# EAGLE board candle (EAGLE 8.5.0)
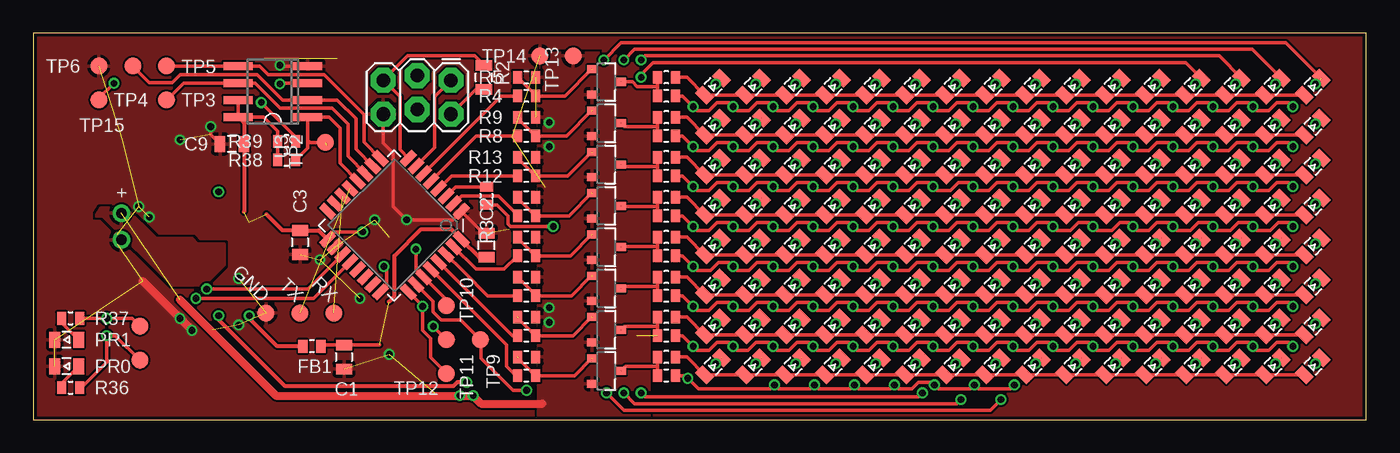
[diagram p1: board, top side]
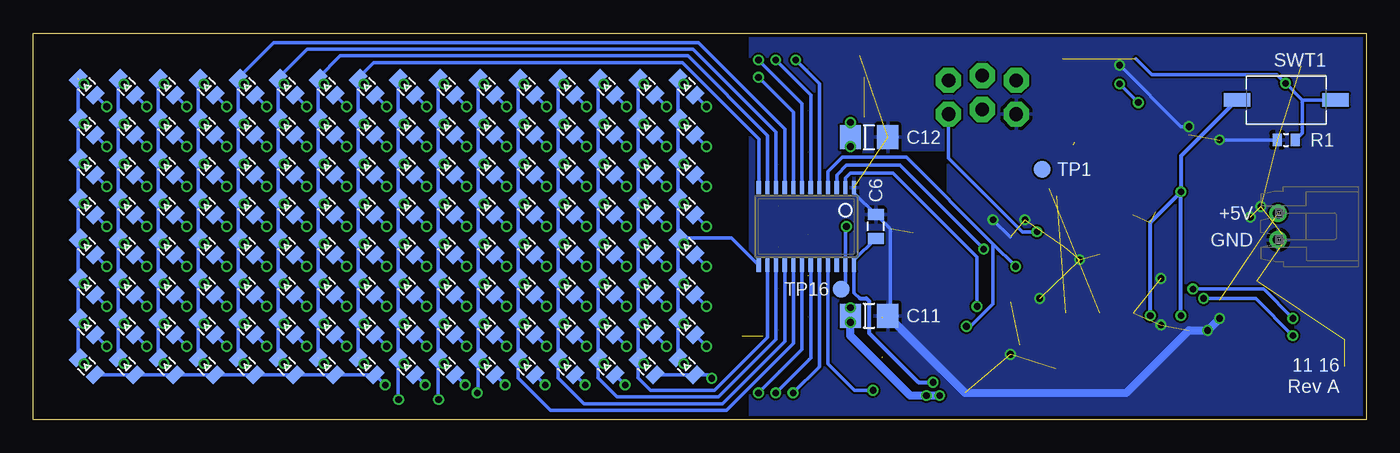
[diagram p2: board, bottom side, seen from below]

Size 100 x 29 mm. Coordinates in mm from the lower left corner, seen from the top.
Outline: 0,0 100,0 100,29 0,29 0,0
Copper layers (1*16): Top 0.035mm / dielectric 1.5mm / Bottom 0.035mm
Design rules "SeeedStudio_2layer_DRU_no_angle_20140221 *": minimum track width 6mil, minimum drill 12mil, track to track 6mil, track to pad 6mil, pad to pad 6mil, via to via 6mil, smd to smd 0mil, copper to edge 10mil, drill to drill 10mil, minimum pad ring 10mil, minimum via ring 6mil, stop-mask expansion 2mil, vias tented up to drill 100mil, thermal gap 10mil

## Footprints (pad centres in the part's own frame; a part is rotated, then mirrored left to right if it is on the bottom)
0805 = smd 0.8 x 1.2: 1 -0.9,0; 2 0.9,0
1206_POL = smd 1.6 x 1.8: 1 -1.4,0; 2 1.4,0
0805_LED = smd 0.8 x 1.2: A -0.9,0; C 0.9,0
0603 = smd 0.7 x 0.95: 1 -0.675,0; 2 0.675,0
B1,27 = smd 1.27 x 1.27: TP 0,0
2X3_LOCK = drill 1.016 pad 1.88 octagon: 1 -2.54,-1.27; 2 -2.54,1.27; 3 0,-1.626; 4 0,0.914; 5 2.54,-1.27; 6 2.54,1.27
1X2_MOLEX_53254 = drill 0.8: 1 -1,0; 2 1,0
SOT23 = smd 0.6 x 0.7: 1 -0.95,-1.1; 2 0.95,-1.1; 3 0,1.1
BTN_SMD_2PIN = smd 2 x 1: 1 -3.7,0; 2 3.7,0
TQFP32 = smd 1.27 x 0.559: 1 -4.42,2.8; 2 -4.42,2; 3 -4.42,1.2; 4 -4.42,0.4; 5 -4.42,-0.4; 6 -4.42,-1.2; 7 -4.42,-2; 8 -4.42,-2.8; 17 4.166,-2.8; 18 4.166,-2; 19 4.166,-1.2; 20 4.166,-0.4; 21 4.166,0.4; 22 4.166,1.2; 23 4.166,2; 24 4.166,2.8 | smd 0.559 x 1.27: 9 -2.927,-4.293; 10 -2.127,-4.293; 11 -1.327,-4.293; 12 -0.527,-4.293; 13 0.273,-4.293; 14 1.073,-4.293; 15 1.873,-4.293; 16 2.673,-4.293; 25 2.673,4.293; 26 1.873,4.293; 27 1.073,4.293; 28 0.273,4.293; 29 -0.527,4.293; 30 -1.327,4.293; 31 -2.127,4.293; 32 -2.927,4.293
SO8 = smd 0.6 x 2.2: 1 -1.905,-2.6; 2 -0.635,-2.6; 3 0.635,-2.6; 4 1.905,-2.6; 5 1.905,2.6; 6 0.635,2.6; 7 -0.635,2.6; 8 -1.905,2.6
TSSOP24 = smd 0.305 x 0.991: 1 -3.575,-2.918; 2 -2.925,-2.918; 3 -2.275,-2.918; 4 -1.625,-2.918; 5 -0.975,-2.918; 6 -0.325,-2.918; 7 0.325,-2.918; 8 0.975,-2.918; 9 1.625,-2.918; 10 2.275,-2.918; 11 2.925,-2.918; 12 3.575,-2.918; 13 3.575,2.918; 14 2.925,2.918; 15 2.275,2.918; 16 1.625,2.918; 17 0.975,2.918; 18 0.325,2.918; 19 -0.325,2.918; 20 -0.975,2.918; 21 -1.625,2.918; 22 -2.275,2.918; 23 -2.925,2.918; 24 -3.575,2.918

## Placement (x,y rotation side)
C1  10u  [0805]  23.3,4.7 270 top
C2  .1u  [0805]  34,13.1 90 top
C3  .1u  [0805]  20,13.3 270 top
C6  .1u  [0805]  36.8,14.5 90 bottom
C9  .1u  [0805]  14.9,20.7 180 top
C11  [1206_POL]  37.3,7.8 0 bottom
C12  [1206_POL]  37.3,21.2 0 bottom
D1  [0805_LED]  96,25 45 top
D2  [0805_LED]  93,25 45 top
D3  [0805_LED]  90,25 45 top
D4  [0805_LED]  87,25 45 top
D5  [0805_LED]  84,25 45 top
D6  [0805_LED]  81,25 45 top
D7  [0805_LED]  78,25 45 top
D8  [0805_LED]  75,25 45 top
D9  [0805_LED]  72,25 45 top
D10  [0805_LED]  69,25 45 top
D11  [0805_LED]  66,25 45 top
D12  [0805_LED]  63,25 45 top
D13  [0805_LED]  60,25 45 top
D14  [0805_LED]  57,25 45 top
D15  [0805_LED]  54,25 45 top
D16  [0805_LED]  51,25 45 top
D17  [0805_LED]  96,25 135 bottom
D18  [0805_LED]  93,25 135 bottom
D19  [0805_LED]  90,25 135 bottom
D20  [0805_LED]  87,25 135 bottom
D21  [0805_LED]  84,25 135 bottom
D22  [0805_LED]  81,25 135 bottom
D23  [0805_LED]  78,25 135 bottom
D24  [0805_LED]  75,25 135 bottom
D25  [0805_LED]  72,25 135 bottom
D26  [0805_LED]  69,25 135 bottom
D27  [0805_LED]  66,25 135 bottom
D28  [0805_LED]  63,25 135 bottom
D29  [0805_LED]  60,25 135 bottom
D30  [0805_LED]  57,25 135 bottom
D31  [0805_LED]  54,25 135 bottom
D32  [0805_LED]  51,25 135 bottom
D33  [0805_LED]  96,22 45 top
D34  [0805_LED]  93,22 45 top
D35  [0805_LED]  90,22 45 top
D36  [0805_LED]  87,22 45 top
D37  [0805_LED]  84,22 45 top
D38  [0805_LED]  81,22 45 top
D39  [0805_LED]  78,22 45 top
D40  [0805_LED]  75,22 45 top
D41  [0805_LED]  72,22 45 top
D42  [0805_LED]  69,22 45 top
D43  [0805_LED]  66,22 45 top
D44  [0805_LED]  63,22 45 top
D45  [0805_LED]  60,22 45 top
D46  [0805_LED]  57,22 45 top
D47  [0805_LED]  54,22 45 top
D48  [0805_LED]  51,22 45 top
D49  [0805_LED]  96,22 135 bottom
D50  [0805_LED]  93,22 135 bottom
D51  [0805_LED]  90,22 135 bottom
D52  [0805_LED]  87,22 135 bottom
D53  [0805_LED]  84,22 135 bottom
D54  [0805_LED]  81,22 135 bottom
D55  [0805_LED]  78,22 135 bottom
D56  [0805_LED]  75,22 135 bottom
D57  [0805_LED]  72,22 135 bottom
D58  [0805_LED]  69,22 135 bottom
D59  [0805_LED]  66,22 135 bottom
D60  [0805_LED]  63,22 135 bottom
D61  [0805_LED]  60,22 135 bottom
D62  [0805_LED]  57,22 135 bottom
D63  [0805_LED]  54,22 135 bottom
D64  [0805_LED]  51,22 135 bottom
D65  [0805_LED]  96,19 45 top
D66  [0805_LED]  93,19 45 top
D67  [0805_LED]  90,19 45 top
D68  [0805_LED]  87,19 45 top
D69  [0805_LED]  84,19 45 top
D70  [0805_LED]  81,19 45 top
D71  [0805_LED]  78,19 45 top
D72  [0805_LED]  75,19 45 top
D73  [0805_LED]  72,19 45 top
D74  [0805_LED]  69,19 45 top
D75  [0805_LED]  66,19 45 top
D76  [0805_LED]  63,19 45 top
D77  [0805_LED]  60,19 45 top
D78  [0805_LED]  57,19 45 top
D79  [0805_LED]  54,19 45 top
D80  [0805_LED]  51,19 45 top
D81  [0805_LED]  96,19 135 bottom
D82  [0805_LED]  93,19 135 bottom
D83  [0805_LED]  90,19 135 bottom
D84  [0805_LED]  87,19 135 bottom
D85  [0805_LED]  84,19 135 bottom
D86  [0805_LED]  81,19 135 bottom
D87  [0805_LED]  78,19 135 bottom
D88  [0805_LED]  75,19 135 bottom
D89  [0805_LED]  72,19 135 bottom
D90  [0805_LED]  69,19 135 bottom
D91  [0805_LED]  66,19 135 bottom
D92  [0805_LED]  63,19 135 bottom
D93  [0805_LED]  60,19 135 bottom
D94  [0805_LED]  57,19 135 bottom
D95  [0805_LED]  54,19 135 bottom
D96  [0805_LED]  51,19 135 bottom
D97  [0805_LED]  96,16 45 top
D98  [0805_LED]  93,16 45 top
D99  [0805_LED]  90,16 45 top
D100  [0805_LED]  87,16 45 top
D101  [0805_LED]  84,16 45 top
D102  [0805_LED]  81,16 45 top
D103  [0805_LED]  78,16 45 top
D104  [0805_LED]  75,16 45 top
D105  [0805_LED]  72,16 45 top
D106  [0805_LED]  69,16 45 top
D107  [0805_LED]  66,16 45 top
D108  [0805_LED]  63,16 45 top
D109  [0805_LED]  60,16 45 top
D110  [0805_LED]  57,16 45 top
D111  [0805_LED]  54,16 45 top
D112  [0805_LED]  51,16 45 top
D113  [0805_LED]  96,16 135 bottom
D114  [0805_LED]  93,16 135 bottom
D115  [0805_LED]  90,16 135 bottom
D116  [0805_LED]  87,16 135 bottom
D117  [0805_LED]  84,16 135 bottom
D118  [0805_LED]  81,16 135 bottom
D119  [0805_LED]  78,16 135 bottom
D120  [0805_LED]  75,16 135 bottom
D121  [0805_LED]  72,16 135 bottom
D122  [0805_LED]  69,16 135 bottom
D123  [0805_LED]  66,16 135 bottom
D124  [0805_LED]  63,16 135 bottom
D125  [0805_LED]  60,16 135 bottom
D126  [0805_LED]  57,16 135 bottom
D127  [0805_LED]  54,16 135 bottom
D128  [0805_LED]  51,16 135 bottom
D129  [0805_LED]  96,13 45 top
D130  [0805_LED]  93,13 45 top
D131  [0805_LED]  90,13 45 top
D132  [0805_LED]  87,13 45 top
D133  [0805_LED]  84,13 45 top
D134  [0805_LED]  81,13 45 top
D135  [0805_LED]  78,13 45 top
D136  [0805_LED]  75,13 45 top
D137  [0805_LED]  72,13 45 top
D138  [0805_LED]  69,13 45 top
D139  [0805_LED]  66,13 45 top
D140  [0805_LED]  63,13 45 top
D141  [0805_LED]  60,13 45 top
D142  [0805_LED]  57,13 45 top
D143  [0805_LED]  54,13 45 top
D144  [0805_LED]  51,13 45 top
D145  [0805_LED]  96,13 135 bottom
D146  [0805_LED]  93,13 135 bottom
D147  [0805_LED]  90,13 135 bottom
D148  [0805_LED]  87,13 135 bottom
D149  [0805_LED]  84,13 135 bottom
D150  [0805_LED]  81,13 135 bottom
D151  [0805_LED]  78,13 135 bottom
D152  [0805_LED]  75,13 135 bottom
D153  [0805_LED]  72,13 135 bottom
D154  [0805_LED]  69,13 135 bottom
D155  [0805_LED]  66,13 135 bottom
D156  [0805_LED]  63,13 135 bottom
D157  [0805_LED]  60,13 135 bottom
D158  [0805_LED]  57,13 135 bottom
D159  [0805_LED]  54,13 135 bottom
D160  [0805_LED]  51,13 135 bottom
D161  [0805_LED]  96,10 45 top
D162  [0805_LED]  93,10 45 top
D163  [0805_LED]  90,10 45 top
D164  [0805_LED]  87,10 45 top
D165  [0805_LED]  84,10 45 top
D166  [0805_LED]  81,10 45 top
D167  [0805_LED]  78,10 45 top
D168  [0805_LED]  75,10 45 top
D169  [0805_LED]  72,10 45 top
D170  [0805_LED]  69,10 45 top
D171  [0805_LED]  66,10 45 top
D172  [0805_LED]  63,10 45 top
D173  [0805_LED]  60,10 45 top
D174  [0805_LED]  57,10 45 top
D175  [0805_LED]  54,10 45 top
D176  [0805_LED]  51,10 45 top
D177  [0805_LED]  96,10 135 bottom
D178  [0805_LED]  93,10 135 bottom
D179  [0805_LED]  90,10 135 bottom
D180  [0805_LED]  87,10 135 bottom
D181  [0805_LED]  84,10 135 bottom
D182  [0805_LED]  81,10 135 bottom
D183  [0805_LED]  78,10 135 bottom
D184  [0805_LED]  75,10 135 bottom
D185  [0805_LED]  72,10 135 bottom
D186  [0805_LED]  69,10 135 bottom
D187  [0805_LED]  66,10 135 bottom
D188  [0805_LED]  63,10 135 bottom
D189  [0805_LED]  60,10 135 bottom
D190  [0805_LED]  57,10 135 bottom
D191  [0805_LED]  54,10 135 bottom
D192  [0805_LED]  51,10 135 bottom
D193  [0805_LED]  96,7 45 top
D194  [0805_LED]  93,7 45 top
D195  [0805_LED]  90,7 45 top
D196  [0805_LED]  87,7 45 top
D197  [0805_LED]  84,7 45 top
D198  [0805_LED]  81,7 45 top
D199  [0805_LED]  78,7 45 top
D200  [0805_LED]  75,7 45 top
D201  [0805_LED]  72,7 45 top
D202  [0805_LED]  69,7 45 top
D203  [0805_LED]  66,7 45 top
D204  [0805_LED]  63,7 45 top
D205  [0805_LED]  60,7 45 top
D206  [0805_LED]  57,7 45 top
D207  [0805_LED]  54,7 45 top
D208  [0805_LED]  51,7 45 top
D209  [0805_LED]  96,7 135 bottom
D210  [0805_LED]  93,7 135 bottom
D211  [0805_LED]  90,7 135 bottom
D212  [0805_LED]  87,7 135 bottom
D213  [0805_LED]  84,7 135 bottom
D214  [0805_LED]  81,7 135 bottom
D215  [0805_LED]  78,7 135 bottom
D216  [0805_LED]  75,7 135 bottom
D217  [0805_LED]  72,7 135 bottom
D218  [0805_LED]  69,7 135 bottom
D219  [0805_LED]  66,7 135 bottom
D220  [0805_LED]  63,7 135 bottom
D221  [0805_LED]  60,7 135 bottom
D222  [0805_LED]  57,7 135 bottom
D223  [0805_LED]  54,7 135 bottom
D224  [0805_LED]  51,7 135 bottom
D225  [0805_LED]  96,4 45 top
D226  [0805_LED]  93,4 45 top
D227  [0805_LED]  90,4 45 top
D228  [0805_LED]  87,4 45 top
D229  [0805_LED]  84,4 45 top
D230  [0805_LED]  81,4 45 top
D231  [0805_LED]  78,4 45 top
D232  [0805_LED]  75,4 45 top
D233  [0805_LED]  72,4 45 top
D234  [0805_LED]  69,4 45 top
D235  [0805_LED]  66,4 45 top
D236  [0805_LED]  63,4 45 top
D237  [0805_LED]  60,4 45 top
D238  [0805_LED]  57,4 45 top
D239  [0805_LED]  54,4 45 top
D240  [0805_LED]  51,4 45 top
D241  [0805_LED]  96,4 135 bottom
D242  [0805_LED]  93,4 135 bottom
D243  [0805_LED]  90,4 135 bottom
D244  [0805_LED]  87,4 135 bottom
D245  [0805_LED]  84,4 135 bottom
D246  [0805_LED]  81,4 135 bottom
D247  [0805_LED]  78,4 135 bottom
D248  [0805_LED]  75,4 135 bottom
D249  [0805_LED]  72,4 135 bottom
D250  [0805_LED]  69,4 135 bottom
D251  [0805_LED]  66,4 135 bottom
D252  [0805_LED]  63,4 135 bottom
D253  [0805_LED]  60,4 135 bottom
D254  [0805_LED]  57,4 135 bottom
D255  [0805_LED]  54,4 135 bottom
D256  [0805_LED]  51,4 135 bottom
D257  [0805_LED]  2.5,4 180 top
D258  [0805_LED]  2.5,6 180 top
FB1  FB_0603  [0603]  20.9,5.5 180 top
GND  TPB1,27  [B1,27]  17.46,8 0 top
J1  [2X3_LOCK]  28.8,24.2 180 top
J2  [1X2_MOLEX_53254]  6.6,14.5 270 bottom
Q1  [SOT23]  43,25.35 270 top
Q2  [SOT23]  43,22.25 270 top
Q3  [SOT23]  43,19.15 270 top
Q4  [SOT23]  43,16.05 270 top
Q5  [SOT23]  43,12.95 270 top
Q6  [SOT23]  43,9.85 270 top
Q7  [SOT23]  43,6.75 270 top
Q8  [SOT23]  43,3.65 270 top
R1  [0603]  6,21 0 bottom
R2  10k  [0805]  33.8,25.7 90 top
R3  [0603]  34,16.8 270 top
R4  [0603]  37,24.3 180 top
R5  [0603]  37,25.7 0 top
R6  [0603]  47.5,25.7 180 top
R7  [0603]  47.5,24.3 180 top
R8  [0603]  37,21.3 180 top
R9  [0603]  37,22.7 0 top
R10  [0603]  47.5,22.7 180 top
R11  [0603]  47.5,21.3 180 top
R12  [0603]  37,18.3 180 top
R13  [0603]  37,19.7 0 top
R14  [0603]  47.5,19.7 180 top
R15  [0603]  47.5,18.3 180 top
R16  [0603]  37,15.3 180 top
R17  [0603]  37,16.7 0 top
R18  [0603]  47.5,16.7 180 top
R19  [0603]  47.5,15.3 180 top
R20  [0603]  37,12.3 180 top
R21  [0603]  37,13.7 0 top
R22  [0603]  47.5,13.7 180 top
R23  [0603]  47.5,12.3 180 top
R24  [0603]  37,9.3 180 top
R25  [0603]  37,10.7 0 top
R26  [0603]  47.5,10.7 180 top
R27  [0603]  47.5,9.3 180 top
R28  [0603]  37,6.3 180 top
R29  [0603]  37,7.7 0 top
R30  [0603]  47.5,7.7 180 top
R31  [0603]  47.5,6.3 180 top
R32  [0603]  37,3.3 180 top
R33  [0603]  37,4.7 0 top
R34  [0603]  47.5,4.7 180 top
R35  [0603]  47.5,3.3 180 top
R36  [0603]  2.8,2.4 0 top
R37  [0603]  2.8,7.6 0 top
R38  10k  [0603]  19,19.5 180 top
R39  10k  [0603]  19,20.9 180 top
RX  TPB1,27  [B1,27]  22.54,8 0 top
SWT1  BUTTON_SMD_2P  [BTN_SMD_2PIN]  6,24 180 bottom
TP1  TPB1,27  [B1,27]  24.3,18.8 0 bottom
TP2  TPB1,27  [B1,27]  21.9,20.8 0 top
TP3  TPB1,27  [B1,27]  10,24 0 top
TP4  TPB1,27  [B1,27]  7.46,26.54 0 top
TP5  TPB1,27  [B1,27]  10,26.54 0 top
TP6  TPB1,27  [B1,27]  4.92,26.54 0 top
TP7  TPB1,27  [B1,27]  8,4.46 0 top
TP8  TPB1,27  [B1,27]  8,7 0 top
TP9  TPB1,27  [B1,27]  33.54,6 0 top
TP10  TPB1,27  [B1,27]  31,8.54 0 top
TP11  TPB1,27  [B1,27]  31,6 0 top
TP12  TPB1,27  [B1,27]  31,3.46 0 top
TP13  TPB1,27  [B1,27]  40.5,27.3 0 top
TP14  TPB1,27  [B1,27]  38,27.3 0 top
TP15  TPB1,27  [B1,27]  4.92,24 0 top
TP16  TPB1,27  [B1,27]  39.4,9.8 0 bottom
TX  TPB1,27  [B1,27]  20,8 0 top
U1  ATXMEGA_E5_TQFP  [TQFP32]  27,14.5 225 top
U3  S25FL  [SO8]  17.96,24.63 90 top
U4  STP16CPC26TSSOP24  [TSSOP24]  42,14.5 180 bottom

## Tracks (layer width: path | path; a pad name or v marks a point on that pad's centre or on a via)
!C0
  Top 0.254: U1.6 35.1,24.3 R4.2
!C0_  (1 unrouted)
  Top 0.254: R5.1 37.67,24.35 R4.1 39.9,24.3 Q1.1
!C1
  Top 0.254: U1.5 33.23,21.3 R8.2
!C2
  Top 0.254: U1.4 31.37,18.3 R12.2
!C3
  Top 0.254: U1.2 32.13,16.8 34.9,16.8 36.33,15.38 R16.2
!C3_  (1 unrouted)
  Top 0.254: 37.67,15.35 R16.1 | R16.1 36.33,16.65 R17.1 | Q4.1 40.2,15.3 R16.1
!C4
  Top 0.254: U1.31 33.21,11.3 35.33,11.3 R20.2
!C5
  Top 0.254: U1.30 32.19,11.19 32.3,11.08 34.08,9.3 R24.2
!C5_  (1 unrouted)
  Top 0.254: R25.1 37.67,9.35 R24.1 40.4,9.3 Q6.1
!C6
  Top 0.254: R28.2 35.95,6.3 U1.29
!C6_  (2 unrouted)
  Top 0.254: 36.33,7.65 R28.1 40.5,6.3 Q7.1
!C7
  Top 0.254: U1.28 35.5,5.61 35.5,4 36.2,3.3 R32.2
!C7_  (2 unrouted)
  Top 0.254: 36.33,4.65 R32.1 40.6,3.3 Q8.1
!DISP_OE  (via drill 0.5)
  Top 0.254: v37,2.2 36,2.2 33.6,4.6 33.6,6 TP9.TP 32.04,7.5 30.6,7.5 30,8.1 30,8.85 U1.26
  Bottom 0.254: U4.21 40.38,4.17 38.4,2.2 v37,2.2
!FLASH_CS  (1 unrouted)
  Top 0.254: 20.56,21 U3.1 22.18,22.72 23,21.9 23,19.25 U1.12 | 20.56,21 20.56,20.39 R38.1 | TP2.TP 20.76,20.8 20.56,21
!RESET
  Top 0.254: U1.8 27.5,20.25 27.5,24.23 J1.5 28.09,27.3 33.1,27.3 R2.2
BTN  (via drill 0.5)  (1 unrouted)
  Top 0.254: 4.92,24.12 v6.05,25.25
  Bottom 0.254: 17.3,27.1 16.1,25.9 6.7,25.9 v6.05,25.25 4.8,24 | 4.8,24 SWT1.1 | R1.2 4.8,21.52 4.8,24
COL0  (1 unrouted)
  Top 0.254: R7.2 46.83,25 | 46.83,25 R6.2 | Q1.3 44.95,25.35 45.3,25 46.83,25
COL1  (1 unrouted)
  Top 0.254: R11.2 46.83,22 | 46.83,22 R10.2 | Q2.3 44.35,22 46.83,22
COL2  (1 unrouted)
  Top 0.254: R15.2 46.83,19 | 46.83,19 R14.2 | Q3.3 44.25,19 46.83,19
COL3  (1 unrouted)
  Top 0.254: R19.2 46.83,16 | 46.83,16 R18.2 | Q4.3 44.15,16 46.83,16
COL4  (1 unrouted)
  Top 0.254: R23.2 46.83,13 | 46.83,13 R22.2 | Q5.3 44.15,13 46.83,13
COL5  (1 unrouted)
  Top 0.254: R27.2 46.83,10 | 46.83,10 R26.2 | Q6.3 44.25,10 46.83,10
COL6  (2 unrouted)
  Top 0.254: R31.2 46.83,7 | 46.83,7 R30.2 | Q7.3 44.35,7 46.83,7
COL7  (1 unrouted)
  Top 0.254: R34.2 46.83,4 | 46.83,4 R35.2 | Q8.3 44.45,4 46.83,4
DISP_BIAS
  Top 0.254: U1.3 31.67,17.48 R3.1
DISP_CLK  (via drill 0.5)
  Top 0.254: v28.7,12.8 28.7,11.28 U1.27 31,8.98 TP10.TP
  Bottom 0.254: U4.3 39.73,18.38 39,19.1 35,19.1 v28.7,12.8
DISP_LE  (via drill 0.5)
  Top 0.254: U1.24 26.5,10.04 26.5,11.3 v26.3,11.5 | TP11.TP v30,7
  Bottom 0.254: U4.4 40.38,18.62 39.3,19.7 34.5,19.7 28,13.2 | v26.3,11.5 28,13.2 | v30,7 29.7,7 28,8.7 28,13.2
DISP_SDI  (via drill 0.5)
  Top 0.254: U1.25 29.2,8.52 v29.2,8.5 29.2,6.7 29.8,6.1 29.8,4.66 TP12.TP
  Bottom 0.254: U4.2 39.08,18.12 38.7,18.5 35.5,18.5 29.2,12.2 v29.2,8.5
FLASH_CLK
  Top 0.254: TP3.TP 11.26,25.26 U3.6 16.64,25.26 18.5,23.4 22.4,23.4 23.6,22.2 23.6,19.78 U1.11
FLASH_MISO
  Top 0.254: 19.59,23.99 U3.2 | U1.10 24.2,20.31 24.2,22.6 22.81,23.99 U3.2 | U3.2 21.51,23.99 | TP4.TP 8.7,25.3 10.4,25.3 11,25.9 16.8,25.9 18.71,23.99 U3.2
FLASH_MOSI
  Top 0.254: TP5.TP U3.5 16.97,26.53 17.6,25.9 21.8,25.9 24.8,22.9 24.8,20.84 U1.9
GND  (via drill 0.5)  (21 unrouted)
  Top 0.254: C2.2 33.75,14 U1.1 31.46,15 v28,15 27,16 27,20 26.26,20.74 J1.6 | 14,20.5 C9.2 13.3,21.4 v13.3,22 | GND.TP 17.67,8 | v18.5,26.6 18.57,26.53 U3.4
  Top 0.406: 6.25,13.85 J2.2 6.3,13.2
  Top 0.61: v11.9,6.7 8.2,10.4
  Bottom 0.254: U4.1 38.42,17.02 C6.2 35.7,14.3 35.7,8 C11.2 | v18.5,26.6 13.9,22 v13.3,22 | 26.7,13.7 v28,15 | R1.1 v11,21
  Bottom 0.61: C11.2 30.1,2 18,2 13.3,6.7 v11.9,6.7 v11,7.6
  other vias: 26.7,4.9 24.5,9.1 15.4,10.6 8.7,15.2 7.9,16 25.6,15 15.4,7.1 21.5,12
  pour Top (rank 6): 0,29 100,29 100,0 0,0
  pour Bottom (rank 6): -1,29 46.2,29 46.2,0 -1,0
LED0  (via drill 0.5)
  Top 0.254: U1.20 21.03,9.1 v12.2,9.1 | R36.2 3.6,2.4 5.5,4.3 v5.5,6.3 6.16,6.3 TP7.TP
  Bottom 0.254: v12.2,9.1 8.3,9.1 v5.5,6.3
LED1  (via drill 0.5)
  Top 0.254: U1.19 20.6,9.8 v13,9.8 | R37.2 v5.5,7.6 7.4,7.6 TP8.TP
  Bottom 0.254: v13,9.8 7.7,9.8 v5.5,7.6
N$1
  Top 0.254: D257.A 2.12,2.73 R36.1
N$2
  Top 0.254: D1.A D2.A D3.A D4.A D5.A D6.A D7.A D8.A D9.A D10.A D11.A D12.A D13.A D14.A D15.A D16.A 49.03,25.7 R6.1
N$3  (via drill 0.5)
  Top 0.254: v94.5,23.5 94.2,23.8 93.3,23.8 92.7,23.2 91.8,23.2 v91.5,23.5 91.2,23.8 90.3,23.8 89.7,23.2 88.8,23.2 v88.5,23.5 88.2,23.8 87.3,23.8 86.7,23.2 85.8,23.2 v85.5,23.5 85.2,23.8 84.3,23.8 83.7,23.2 82.8,23.2 v82.5,23.5 82.2,23.8 81.3,23.8 80.7,23.2 79.8,23.2 v79.5,23.5 79.2,23.8 78.3,23.8 77.7,23.2 76.8,23.2 v76.5,23.5 76.2,23.8 75.3,23.8 74.7,23.2 73.8,23.2 v73.5,23.5 73.2,23.8 72.3,23.8 71.7,23.2 70.8,23.2 v70.5,23.5 70.2,23.8 69.3,23.8 68.7,23.2 67.8,23.2 v67.5,23.5 67.2,23.8 66.3,23.8 65.7,23.2 64.8,23.2 v64.5,23.5 64.2,23.8 63.3,23.8 62.7,23.2 61.8,23.2 v61.5,23.5 61.2,23.8 60.3,23.8 59.7,23.2 58.8,23.2 v58.5,23.5 58.2,23.8 57.3,23.8 56.7,23.2 55.8,23.2 v55.5,23.5 55.2,23.8 54.3,23.8 53.7,23.2 52.8,23.2 v52.5,23.5 52.2,23.8 51.3,23.8 50.7,23.2 49.8,23.2 v49.5,23.5 48.7,24.3 R7.1
  Bottom 0.254: D17.A v94.5,23.5 | v91.5,23.5 | v91.5,23.5 D18.A | D31.A v52.5,23.5 | v52.5,23.5 | D32.A v49.5,23.5 | v49.5,23.5 | D30.A v55.5,23.5 | v55.5,23.5 | D29.A v58.5,23.5 | v58.5,23.5 | D28.A v61.5,23.5 | v61.5,23.5 | D27.A v64.5,23.5 | v64.5,23.5 | D26.A v67.5,23.5 | v67.5,23.5 | D25.A v70.5,23.5 | v70.5,23.5 | D24.A v73.5,23.5 | v73.5,23.5 | D23.A v76.5,23.5 | v76.5,23.5 | D22.A v79.5,23.5 | v79.5,23.5 | D21.A v82.5,23.5 | v82.5,23.5 | D20.A v85.5,23.5 | v85.5,23.5 | D19.A v88.5,23.5 | v88.5,23.5
N$4
  cutout Bottom: 32,20 34.9,20 32.1,17.2 31.6,17.2 31.6,20
N$5
  Top 0.254: D258.A 2.12,7.28 R37.1
N$6  (via drill 0.5)
  Top 0.254: U3.3 18.56,25.26 v18.5,25.2 | v17.1,23.8 19.68,21.23 R39.1
  Bottom 0.254: v18.5,25.2 v17.1,23.8
N$7  (1 unrouted)
  Top 0.254: R9.1 36.33,22.65 R8.1 40,21.3 Q2.1
N$8
  Top 0.254: D65.A D66.A D67.A D68.A D69.A D70.A D71.A D72.A D73.A D74.A D75.A D76.A D77.A D78.A D79.A D80.A 49.03,19.7 R14.1
N$9  (via drill 0.5)
  Top 0.254: v94.5,17.5 94.2,17.8 93.3,17.8 92.7,17.2 91.8,17.2 v91.5,17.5 91.2,17.8 90.3,17.8 89.7,17.2 88.8,17.2 v88.5,17.5 88.2,17.8 87.3,17.8 86.7,17.2 85.8,17.2 v85.5,17.5 85.2,17.8 84.3,17.8 83.7,17.2 82.8,17.2 v82.5,17.5 82.2,17.8 81.3,17.8 80.7,17.2 79.8,17.2 v79.5,17.5 79.2,17.8 78.3,17.8 77.7,17.2 76.8,17.2 v76.5,17.5 76.2,17.8 75.3,17.8 74.7,17.2 73.8,17.2 v73.5,17.5 73.2,17.8 72.3,17.8 71.7,17.2 70.8,17.2 v70.5,17.5 70.2,17.8 69.4,17.8 68.8,17.2 67.8,17.2 v67.5,17.5 67.2,17.8 66.3,17.8 65.7,17.2 64.8,17.2 v64.5,17.5 64.2,17.8 63.3,17.8 62.7,17.2 61.8,17.2 v61.5,17.5 61.2,17.8 60.3,17.8 59.7,17.2 58.8,17.2 v58.5,17.5 58.2,17.8 57.3,17.8 56.7,17.2 55.8,17.2 v55.5,17.5 55.2,17.8 54.3,17.8 53.7,17.2 52.8,17.2 v52.5,17.5 52.2,17.8 51.3,17.8 50.7,17.2 49.8,17.2 v49.5,17.5 48.7,18.3 R15.1
  Bottom 0.254: D96.A | D96.A v49.5,17.5 | D95.A | D95.A v52.5,17.5 | D94.A | D94.A v55.5,17.5 | D93.A | D93.A v58.5,17.5 | D92.A | D92.A v61.5,17.5 | D91.A | D91.A v64.5,17.5 | D90.A | D90.A v67.5,17.5 | D89.A | D89.A v70.5,17.5 | D88.A | D88.A v73.5,17.5 | D87.A | D87.A v76.5,17.5 | D86.A | D86.A v79.5,17.5 | D85.A | D85.A v82.5,17.5 | D84.A | D84.A v85.5,17.5 | D83.A | D83.A v88.5,17.5 | D82.A | D82.A v91.5,17.5 | D81.A | D81.A v94.5,17.5
N$10  (via drill 0.5)
  Top 0.254: R3.2 34.77,16.12 35.6,15.3 35.6,14.7 35.8,14.5 v39,14.5
  Bottom 0.254: v39,14.5 39.08,14.43 U4.23 39.08,10.12 TP16.TP
N$11
  Top 0.254: R22.1 49.03,13.7 D144.A D143.A D142.A D141.A D140.A D139.A D138.A D137.A D136.A D135.A D134.A D133.A D132.A D131.A D130.A D129.A
N$12  (via drill 0.5)
  Top 0.254: v94.5,11.5 94.2,11.8 93.3,11.8 92.7,11.2 91.8,11.2 v91.5,11.5 91.2,11.8 90.3,11.8 89.7,11.2 88.8,11.2 v88.5,11.5 88.2,11.8 87.3,11.8 86.7,11.2 85.8,11.2 v85.5,11.5 85.2,11.8 84.3,11.8 83.7,11.2 82.8,11.2 v82.5,11.5 82.2,11.8 81.3,11.8 80.7,11.2 79.8,11.2 v79.5,11.5 79.2,11.8 78.3,11.8 77.7,11.2 76.8,11.2 v76.5,11.5 76.2,11.8 75.3,11.8 74.7,11.2 73.8,11.2 v73.5,11.5 73.2,11.8 72.3,11.8 71.7,11.2 70.8,11.2 v70.5,11.5 70.2,11.8 69.3,11.8 68.7,11.2 67.8,11.2 v67.5,11.5 67.2,11.8 66.3,11.8 65.7,11.2 64.8,11.2 v64.5,11.5 64.2,11.8 63.3,11.8 62.7,11.2 61.8,11.2 v61.5,11.5 61.2,11.8 60.3,11.8 59.7,11.2 58.8,11.2 v58.5,11.5 58.2,11.8 57.3,11.8 56.7,11.2 55.8,11.2 v55.5,11.5 55.2,11.8 54.3,11.8 53.7,11.2 52.8,11.2 v52.5,11.5 52.2,11.8 51.4,11.8 50.8,11.2 49.8,11.2 v49.5,11.5 48.7,12.3 R23.1
  Bottom 0.254: D160.A | D160.A v49.5,11.5 | D159.A v52.5,11.5 | D158.A | D158.A v55.5,11.5 | D157.A | D157.A v58.5,11.5 | D156.A | D156.A v61.5,11.5 | D155.A | D155.A v64.5,11.5 | D154.A | D154.A v67.5,11.5 | D153.A | D153.A v70.5,11.5 | D152.A | D152.A v73.5,11.5 | D151.A | D151.A v76.5,11.5 | D150.A | D150.A v79.5,11.5 | D149.A | D149.A v82.5,11.5 | D148.A | D148.A v85.5,11.5 | D147.A | D147.A v88.5,11.5 | D146.A | D146.A v91.5,11.5 | D145.A | D145.A v94.5,11.5
N$13  (1 unrouted)
  Top 0.254: R13.1 36.33,19.65 R12.1 40.1,18.3 Q3.1
N$14  (1 unrouted)
  Top 0.254: R21.1 36.33,13.65 R20.1 40.3,12.3 Q5.1
N$33
  Top 0.254: R18.1 49.03,16.7 D112.A D111.A D110.A D109.A D108.A D107.A D106.A D105.A D104.A D103.A D102.A D101.A D100.A D99.A D98.A D97.A
N$35  (via drill 0.5)
  Top 0.254: v94.5,14.5 94.2,14.8 93.4,14.8 92.8,14.2 91.8,14.2 v91.5,14.5 91.2,14.8 90.4,14.8 89.8,14.2 88.8,14.2 v88.5,14.5 88.2,14.8 87.4,14.8 86.8,14.2 85.8,14.2 v85.5,14.5 85.2,14.8 84.3,14.8 83.7,14.2 82.8,14.2 v82.5,14.5 82.2,14.8 81.5,14.8 80.9,14.2 79.8,14.2 v79.5,14.5 79.2,14.8 78.4,14.8 77.8,14.2 76.8,14.2 v76.5,14.5 76.2,14.8 75.3,14.8 74.7,14.2 73.8,14.2 v73.5,14.5 73.2,14.8 72.3,14.8 71.7,14.2 70.8,14.2 v70.5,14.5 70.2,14.8 69.3,14.8 68.7,14.2 67.8,14.2 v67.5,14.5 67.2,14.8 66.3,14.8 65.7,14.2 64.8,14.2 v64.5,14.5 64.2,14.8 63.3,14.8 62.7,14.2 61.8,14.2 v61.5,14.5 61.2,14.8 60.3,14.8 59.7,14.2 58.8,14.2 v58.5,14.5 58.2,14.8 57.3,14.8 56.7,14.2 55.8,14.2 v55.5,14.5 55.2,14.8 54.3,14.8 53.7,14.2 52.8,14.2 v52.5,14.5 52.2,14.8 51.3,14.8 50.7,14.2 49.8,14.2 v49.5,14.5 48.7,15.3 R19.1
  Bottom 0.254: D113.A | D113.A v94.5,14.5 | D114.A | D114.A v91.5,14.5 | D115.A | D115.A v88.5,14.5 | D116.A | D116.A v85.5,14.5 | D117.A | D117.A v82.5,14.5 | D118.A | D118.A v79.5,14.5 | D119.A | D119.A v76.5,14.5 | D120.A | D120.A v73.5,14.5 | D121.A | D121.A v70.5,14.5 | D122.A | D122.A v67.5,14.5 | D123.A | D123.A v64.5,14.5 | D124.A | D124.A v61.5,14.5 | D125.A | D125.A v58.5,14.5 | D126.A | D126.A v55.5,14.5 | D127.A | D127.A v52.5,14.5 | D128.A | D128.A v49.5,14.5
N$42
  Top 0.254: R26.1 49.03,10.7 D176.A D175.A D174.A D173.A D172.A D171.A D170.A D169.A D168.A D167.A D166.A D165.A D164.A D163.A D162.A D161.A
N$44  (via drill 0.5)
  Top 0.254: v94.5,8.5 94.2,8.8 93.3,8.8 92.7,8.2 91.8,8.2 v91.5,8.5 91.2,8.8 90.3,8.8 89.7,8.2 88.8,8.2 v88.5,8.5 88.2,8.8 87.3,8.8 86.7,8.2 85.8,8.2 v85.5,8.5 85.2,8.8 84.3,8.8 83.7,8.2 82.8,8.2 v82.5,8.5 82.2,8.8 81.3,8.8 80.7,8.2 79.8,8.2 v79.5,8.5 79.2,8.8 78.3,8.8 77.7,8.2 76.8,8.2 v76.5,8.5 76.2,8.8 75.3,8.8 74.7,8.2 73.8,8.2 v73.5,8.5 73.2,8.8 72.3,8.8 71.7,8.2 70.8,8.2 v70.5,8.5 70.2,8.8 69.3,8.8 68.7,8.2 67.8,8.2 v67.5,8.5 67.2,8.8 66.3,8.8 65.7,8.2 64.8,8.2 v64.5,8.5 64.2,8.8 63.3,8.8 62.7,8.2 61.8,8.2 v61.5,8.5 61.2,8.8 60.3,8.8 59.7,8.2 58.8,8.2 v58.5,8.5 58.2,8.8 57.3,8.8 56.7,8.2 55.8,8.2 v55.5,8.5 55.2,8.8 54.3,8.8 53.7,8.2 52.8,8.2 v52.5,8.5 52.2,8.8 51.3,8.8 50.7,8.2 49.8,8.2 v49.5,8.5 48.7,9.3 R27.1
  Bottom 0.254: D191.A v52.5,8.5 | D192.A | D192.A v49.5,8.5 | D190.A | D190.A v55.5,8.5 | D189.A | D189.A v58.5,8.5 | D188.A | D188.A v61.5,8.5 | D187.A | D187.A v64.5,8.5 | D183.A | D183.A v76.5,8.5 | D184.A | D184.A v73.5,8.5 | D185.A | D185.A v70.5,8.5 | D180.A | D180.A v85.5,8.5 | D181.A | D181.A v82.5,8.5 | D182.A | D182.A v79.5,8.5 | D179.A | D179.A v88.5,8.5 | D177.A | D177.A v94.5,8.5 | D178.A | D178.A v91.5,8.5 | D186.A | D186.A v67.5,8.5
N$47
  Top 0.254: R30.1 49.03,7.7 D208.A D207.A D206.A D205.A D204.A D203.A D202.A D201.A D200.A D199.A D198.A D197.A D196.A D195.A D194.A D193.A
N$48  (via drill 0.5)
  Top 0.254: v94.5,5.5 94.2,5.8 93.3,5.8 92.7,5.2 91.8,5.2 v91.5,5.5 91.2,5.8 90.3,5.8 89.7,5.2 88.8,5.2 v88.5,5.5 88.2,5.8 87.3,5.8 86.7,5.2 85.8,5.2 v85.5,5.5 85.2,5.8 84.3,5.8 83.7,5.2 82.8,5.2 v82.5,5.5 82.2,5.8 81.3,5.8 80.7,5.2 79.8,5.2 v79.5,5.5 79.2,5.8 78.3,5.8 77.7,5.2 76.8,5.2 v76.5,5.5 76.2,5.8 75.3,5.8 74.7,5.2 73.8,5.2 v73.5,5.5 73.2,5.8 72.3,5.8 71.7,5.2 70.8,5.2 v70.5,5.5 70.2,5.8 69.3,5.8 68.7,5.2 67.8,5.2 v67.5,5.5 67.2,5.8 66.3,5.8 65.7,5.2 64.8,5.2 v64.5,5.5 64.2,5.8 63.3,5.8 62.7,5.2 61.8,5.2 v61.5,5.5 61.2,5.8 60.3,5.8 59.7,5.2 58.8,5.2 v58.5,5.5 58.2,5.8 57.3,5.8 56.7,5.2 55.8,5.2 v55.5,5.5 55.2,5.8 54.2,5.8 53.6,5.2 52.8,5.2 v52.5,5.5 52.2,5.8 51.3,5.8 50.7,5.2 49.8,5.2 v49.5,5.5 48.7,6.3 R31.1
  Bottom 0.254: D221.A | D221.A v58.5,5.5 | D222.A | D222.A v55.5,5.5 | D223.A | D223.A v52.5,5.5 | D224.A | D224.A v49.5,5.5 | D219.A | D219.A v64.5,5.5 | D220.A | D220.A v61.5,5.5 | D218.A | D218.A v67.5,5.5 | D217.A | D217.A v70.5,5.5 | D216.A | D216.A v73.5,5.5 | D215.A | D215.A v76.5,5.5 | D214.A | D214.A v79.5,5.5 | D213.A | D213.A v82.5,5.5 | D212.A | D212.A v85.5,5.5 | D211.A | D211.A v88.5,5.5 | D210.A | D210.A v91.5,5.5 | D209.A | D209.A v94.5,5.5
N$51
  Top 0.254: R34.1 49.03,4.7 D240.A D239.A D238.A D237.A D236.A D235.A D234.A D233.A D232.A D231.A D230.A D229.A D228.A D227.A D226.A D225.A
N$52  (via drill 0.5)
  Top 0.254: v73.6,2.6 73.3,2.3 70.9,2.3 v70.6,2.6 70.3,2.3 67.9,2.3 v67.6,2.6 67.4,2.8 66.4,2.8 65.9,2.3 64.9,2.3 v64.6,2.6 64.3,2.3 61.9,2.3 v61.6,2.6 61.3,2.3 58.9,2.3 v58.6,2.6 58.3,2.3 55.9,2.3 v55.6,2.6 55.3,2.3 49.9,2.3 v49.1,3.1 48.9,3.3 R35.1
  Bottom 0.254: D248.A D247.A D246.A D245.A D244.A D243.A D242.A D241.A | D251.A | D251.A v64.6,2.6 | D252.A | D252.A v61.6,2.6 | D253.A | D253.A v58.6,2.6 | D254.A | D254.A v55.6,2.6 | D256.A | D250.A | D250.A v67.6,2.6 | D249.A | D249.A v70.6,2.6 | D248.A | D248.A v73.6,2.6 | D255.A D256.A | D256.A 49.36,3.36 v49.1,3.1
N$53
  Top 0.254: D33.A D34.A D35.A D36.A D37.A D38.A D39.A D40.A D41.A D42.A D43.A D44.A D45.A D46.A D47.A D48.A 49.03,22.7 R10.1
N$54  (via drill 0.5)
  Top 0.254: v94.5,20.5 94.2,20.8 93.3,20.8 92.7,20.2 91.8,20.2 v91.5,20.5 91.2,20.8 90.3,20.8 89.7,20.2 88.8,20.2 v88.5,20.5 88.2,20.8 87.3,20.8 86.7,20.2 85.8,20.2 v85.5,20.5 85.2,20.8 84.3,20.8 83.7,20.2 82.8,20.2 v82.5,20.5 82.2,20.8 81.3,20.8 80.7,20.2 79.8,20.2 v79.5,20.5 79.2,20.8 78.3,20.8 77.7,20.2 76.8,20.2 v76.5,20.5 76.2,20.8 75.3,20.8 74.7,20.2 73.8,20.2 v73.5,20.5 73.2,20.8 72.3,20.8 71.7,20.2 70.8,20.2 v70.5,20.5 70.2,20.8 69.3,20.8 68.7,20.2 67.8,20.2 v67.5,20.5 67.2,20.8 66.3,20.8 65.7,20.2 64.8,20.2 v64.5,20.5 64.2,20.8 63.3,20.8 62.7,20.2 61.8,20.2 v61.5,20.5 61.2,20.8 60.3,20.8 59.7,20.2 58.8,20.2 v58.5,20.5 58.2,20.8 57.3,20.8 56.7,20.2 55.8,20.2 v55.5,20.5 55.2,20.8 54.3,20.8 53.7,20.2 52.8,20.2 v52.5,20.5 52.2,20.8 51.3,20.8 50.7,20.2 49.8,20.2 v49.5,20.5 48.7,21.3 R11.1
  Bottom 0.254: D49.A v94.5,20.5 | v94.5,20.5 | D50.A v91.5,20.5 | v91.5,20.5 | D51.A v88.5,20.5 | v88.5,20.5 | D52.A v85.5,20.5 | v85.5,20.5 | D53.A v82.5,20.5 | v82.5,20.5 | D54.A v79.5,20.5 | v79.5,20.5 | D55.A v76.5,20.5 | v76.5,20.5 | D56.A v73.5,20.5 | v73.5,20.5 | D57.A v70.5,20.5 | v70.5,20.5 | D58.A v67.5,20.5 | v67.5,20.5 | D59.A v64.5,20.5 | v64.5,20.5 | D60.A v61.5,20.5 | v61.5,20.5 | D61.A v58.5,20.5 | v58.5,20.5 | D62.A v55.5,20.5 | v55.5,20.5 | D63.A v52.5,20.5 | v52.5,20.5 | D64.A v49.5,20.5 | v49.5,20.5
PDI
  Top 0.254: U1.7 30.1,20.43 30.1,24.23 J1.1
PVDD  (via drill 0.5)  (2 unrouted)
  Top 0.406: J2.1 6.3,15.8
  Top 0.61: 11,9 18.2,1.8 v32,1.8 v33,1.8 33.6,1.2 38.2,1.2
  Bottom 0.254: C12.1 v38.7,20.5
  Bottom 0.61: v38.7,8.4 C11.1 v38.7,7.3 38.7,6.3 34.2,1.8 v33,1.8 v32,1.8
  other vias: 38.7,22.3
  pour Top: 46.2,0 46.2,27.5 37.9,27.5 37.9,0.1
  pour Top: 5.2,15.3 4.7,15.3 5.1,15.9 6.9,15.9 9.2,13.6 11.9,13.6 12.3,13.2 14.3,13.2 14.3,11.6 12.8,10.1 10.4,10.1
ROW0  (via drill 0.5)  (1 unrouted)
  Top 0.254: v96.2,22.2 D33.C | v42.8,27 44.1,28.3 93.97,28.3 96.74,25.54 96.58,25.54 | D65.C v96.2,19.2 | D97.C v96.2,16.2 | D129.C v96.2,13.2 | D161.C v96.2,10.2 | v96.2,7.2 D193.C | v96.2,4.2 D225.C | D1.C v96.2,25.2
  Bottom 0.254: D33.C v96.2,22.2 | D33.C D1.C v96.2,25.2 | D65.C D33.C | D97.C D65.C | D97.C D129.C | D129.C | D129.C D161.C | D161.C D193.C | D225.C | U4.5 41.02,25.23 v42.8,27 | v96.2,25.2 | v96.2,19.2 D65.C | D65.C | v96.2,16.2 D97.C | D97.C | v96.2,13.2 D129.C | D161.C | D193.C v96.2,7.2 | v96.2,7.2 | D225.C v96.2,4.2 | D129.C | v96.2,10.2 D161.C | D225.C | D225.C D193.C | D193.C v96.2,7.2
ROW1  (via drill 0.5)  (2 unrouted)
  Top 0.254: v93.2,22.2 D34.C | v93.2,25.2 D2.C 91.47,27.8 45.1,27.8 v44.3,27 | v93.2,19.2 D66.C | D98.C v93.2,16.2 | v93.2,13.2 D130.C | v93.2,10.2 D162.C | v93.2,7.2 D194.C | D226.C v93.2,4.2
  Bottom 0.254: D34.C v93.2,22.2 | v93.2,25.2 D2.C D34.C | D98.C D66.C | D66.C D34.C | D98.C D130.C | D130.C | D162.C D194.C | U4.6 41.67,24.38 v44.3,27 | D66.C v93.2,19.2 | v93.2,19.2 | v93.2,16.2 D98.C | D98.C | v93.2,13.2 D130.C | D162.C v93.2,10.2 | v93.2,10.2 | D194.C v93.2,7.2 | v93.2,7.2 | v93.2,4.2 D226.C D194.C | D194.C v93.2,7.2 | D162.C | D162.C D130.C
ROW2  (via drill 0.5)  (1 unrouted)
  Top 0.254: v90.2,22.2 D35.C | v90.2,25.2 D3.C 88.97,27.3 45.9,27.3 v45.6,27 | v90.2,4.2 D227.C | v90.2,7.2 D195.C | v90.2,10.2 D163.C | v90.2,13.2 D131.C | D99.C v90.2,16.2 | v90.2,19.2 D67.C
  Bottom 0.254: D35.C v90.2,22.2 | v90.2,25.2 D3.C D35.C | D99.C D67.C | D67.C D35.C | D99.C D131.C | D131.C | D163.C D195.C | U4.7 42.33,23.73 v45.6,27 | D227.C v90.2,4.2 | D195.C v90.2,7.2 | v90.2,7.2 | D163.C v90.2,10.2 | v90.2,10.2 | D131.C v90.2,13.2 | v90.2,16.2 D99.C | D99.C | D67.C v90.2,19.2 | v90.2,19.2 | D227.C | D227.C | D227.C D195.C | D195.C v90.2,7.2 | D163.C | D163.C D131.C
ROW3  (via drill 0.5)  (2 unrouted)
  Top 0.254: v87.2,25.2 D4.C 86.47,26.8 46.5,26.8 45.6,25.9 v45.6,25.7 | v87.2,22.2 D36.C | D68.C v87.2,19.2 | v87.2,16.2 D100.C | v87.2,13.2 D132.C | D164.C v87.2,10.2 | v87.2,7.2 D196.C | D228.C v87.2,4.2
  Bottom 0.254: D100.C D68.C | D68.C D36.C | D36.C D4.C v87.2,25.2 | D100.C D132.C | D132.C | D164.C D196.C | v87.2,25.2 | U4.8 42.98,23.07 v45.6,25.7 | D36.C v87.2,22.2 | v87.2,22.2 | v87.2,19.2 D68.C | D68.C | D100.C v87.2,16.2 | v87.2,16.2 | D132.C v87.2,13.2 | v87.2,10.2 D164.C | D164.C | D196.C v87.2,7.2 | v87.2,7.2 | v87.2,4.2 D228.C D196.C | D196.C v87.2,7.2 | D164.C D132.C
ROW4  (via drill 0.5)  (2 unrouted)
  Top 0.254: D5.C v84.2,25.2 | v84.2,4.2 D229.C | v84.2,7.2 D197.C | D165.C v84.2,10.2 | v84.2,13.2 D133.C | D101.C v84.2,16.2 | D69.C v84.2,19.2 | v84.2,22.2 D37.C | D37.C
  Bottom 0.254: D101.C D69.C | D69.C D37.C | D37.C D5.C | D101.C D133.C | D133.C | D165.C D197.C | D5.C | v84.2,25.2 D5.C | U4.9 43.62,21.82 50.1,28.3 81.97,28.3 D5.C | v84.2,4.2 D229.C D197.C | D197.C v84.2,7.2 | v84.2,7.2 | v84.2,10.2 D165.C | D165.C | D133.C v84.2,13.2 | v84.2,16.2 D101.C | D101.C | v84.2,19.2 D69.C | D69.C | D37.C v84.2,22.2 | v84.2,22.2 | v84.2,22.2 D37.C | D197.C v84.2,7.2 | D165.C D133.C
ROW5  (via drill 0.5)  (1 unrouted)
  Top 0.254: D6.C v81.2,25.2 | v81.2,22.2 D38.C | v81.2,19.2 D70.C | v81.2,16.2 D102.C | D102.C | v81.2,13.2 D134.C | v81.2,10.2 D166.C | v81.2,7.2 D198.C | D230.C v81.2,4.2
  Bottom 0.254: D6.C D38.C | D38.C | D70.C D102.C | D102.C D198.C | D6.C | D6.C v81.2,25.2 | U4.10 44.27,21.57 50.5,27.8 79.47,27.8 D6.C | D38.C v81.2,22.2 | v81.2,22.2 | D70.C v81.2,19.2 | v81.2,19.2 | D102.C v81.2,16.2 | v81.2,16.2 | v81.2,16.2 D102.C | D134.C v81.2,13.2 | v81.2,13.2 | v81.2,10.2 D166.C D134.C | v81.2,10.2 | D198.C v81.2,7.2 | v81.2,7.2 | v81.2,4.2 D230.C D198.C | D198.C v81.2,7.2 | D134.C D102.C | D70.C | D70.C D38.C | D38.C v81.2,22.2
ROW6  (via drill 0.5)  (1 unrouted)
  Top 0.254: v78.2,25.2 D7.C | v78.2,4.2 D231.C | v78.2,7.2 D199.C | v78.2,10.2 D167.C | v78.2,13.2 D135.C | v78.2,16.2 D103.C | v78.2,19.2 D71.C | v78.2,22.2 D39.C
  Bottom 0.254: D7.C D39.C | D39.C | D71.C D199.C | D7.C | D7.C v78.2,25.2 | U4.11 44.92,21.32 50.9,27.3 76.97,27.3 D7.C | v78.2,4.2 D231.C D199.C | D199.C v78.2,7.2 | v78.2,7.2 | v78.2,10.2 D167.C D135.C | v78.2,10.2 | D135.C v78.2,13.2 | v78.2,13.2 | D103.C v78.2,16.2 | v78.2,16.2 | D71.C v78.2,19.2 | v78.2,19.2 | D39.C v78.2,22.2 | v78.2,22.2 | D199.C v78.2,7.2 | D71.C | D71.C D39.C | D39.C v78.2,22.2 | D103.C D71.C | D135.C D103.C
ROW7  (via drill 0.5)  (1 unrouted)
  Top 0.254: D8.C v75.2,25.2 | v75.2,22.2 D40.C | D40.C | v75.2,19.2 D72.C | v75.2,16.2 D104.C | v75.2,13.2 D136.C | D136.C | v75.2,10.2 D168.C | v75.2,7.2 D200.C | D232.C v75.2,4.2
  Bottom 0.254: D8.C D40.C | D40.C | D40.C D72.C | D104.C D136.C | D136.C D168.C | D200.C | D8.C | D8.C v75.2,25.2 | U4.12 45.58,21.07 51.3,26.8 74.47,26.8 D8.C | D40.C v75.2,22.2 | v75.2,22.2 | v75.2,22.2 D40.C | D72.C v75.2,19.2 | v75.2,19.2 | D104.C v75.2,16.2 | v75.2,16.2 | D136.C | v75.2,13.2 | v75.2,13.2 D136.C | v75.2,13.2 D136.C | D136.C | D168.C v75.2,10.2 | v75.2,10.2 | D200.C v75.2,7.2 | v75.2,7.2 | v75.2,4.2 D232.C D200.C | D200.C v75.2,7.2 | D104.C | D104.C D72.C | D72.C v75.2,19.2 | D200.C | D200.C D168.C | D168.C v75.2,10.2
ROW8  (via drill 0.5)
  Top 0.254: v72.2,25.2 D9.C | v72.6,1.5 71.8,0.7 44.3,0.7 v43,2 | v72.2,7.2 D201.C | v72.2,4.2 D233.C | v72.2,10.2 D169.C | v72.2,13.2 D137.C | D105.C v72.2,16.2 | D73.C v72.2,19.2 | v72.2,22.2 D41.C
  Bottom 0.254: D9.C D41.C | D41.C | D73.C 72.64,14 | D137.C D169.C | D233.C 72.64,1.54 v72.6,1.5 | D9.C | D9.C v72.2,25.2 | D201.C | D201.C v72.2,7.2 | U4.20 41.02,3.98 v43,2 | D233.C v72.2,4.2 | v72.2,4.2 | D169.C v72.2,10.2 | v72.2,10.2 | D137.C | v72.2,13.2 | v72.2,16.2 D105.C | D105.C | v72.2,19.2 D73.C | D73.C | D41.C v72.2,22.2 | v72.2,22.2 | D233.C | D233.C D201.C | D201.C D169.C | D169.C v72.2,10.2 | v72.2,13.2 D137.C | D137.C 72.64,14 | 72.64,14 | 72.64,14 D105.C | D73.C D41.C | D41.C v72.2,22.2
ROW9  (via drill 0.5)
  Top 0.254: D10.C v69.2,25.2 | v69.6,1.5 69.3,1.2 45.1,1.2 v44.3,2 | v69.2,22.2 D42.C | v69.2,19.2 D74.C | v69.2,16.2 D106.C | D138.C v69.2,13.2 | v69.2,10.2 D170.C | v69.2,4.2 D234.C | v69.2,7.2 D202.C
  Bottom 0.254: D10.C D42.C | D42.C | D74.C D106.C | D138.C D170.C | D202.C | D202.C 69.64,1.54 v69.6,1.5 | D10.C | D10.C v69.2,25.2 | v69.2,7.2 D202.C | U4.19 41.67,4.62 v44.3,2 | D42.C v69.2,22.2 | v69.2,22.2 | D74.C v69.2,19.2 | v69.2,19.2 | D106.C v69.2,16.2 | v69.2,16.2 | v69.2,13.2 D138.C | D138.C | D170.C v69.2,10.2 | v69.2,10.2 | v69.2,4.2 D234.C D202.C | v69.2,4.2 | D202.C | D202.C | D202.C D170.C | D170.C v69.2,10.2 | D170.C D138.C | D138.C D106.C | D106.C v69.2,16.2 | D74.C | D74.C D42.C | D42.C v69.2,22.2
ROW10  (via drill 0.5)
  Top 0.254: D11.C v66.2,25.2 | v66.7,2 66.4,1.7 45.9,1.7 v45.6,2 | D235.C v66.2,4.2 | v66.2,13.2 D139.C | D139.C | v66.2,16.2 D107.C | v66.2,19.2 D75.C | D43.C v66.2,22.2 | v66.2,10.2 D171.C | D171.C | 66.64,7.3 D203.C v66.2,7.2
  Bottom 0.254: D11.C | D11.C v66.2,25.2 | D235.C 66.64,1.94 v66.7,2 | D11.C D43.C | D43.C | D43.C D75.C | D75.C D107.C | D107.C | D107.C D139.C | D139.C D171.C | D171.C | D203.C D235.C | D235.C | D171.C v66.2,10.2 | U4.18 42.33,5.28 v45.6,2 | v66.2,4.2 D235.C | D235.C | D139.C v66.2,13.2 | D107.C v66.2,16.2 | v66.2,16.2 | D75.C v66.2,19.2 | v66.2,19.2 | v66.2,19.2 D75.C | v66.2,22.2 D43.C | D43.C | v66.2,7.2 D203.C | D203.C | D203.C | D203.C D171.C | D171.C v66.2,10.2 | v66.2,10.2 | D139.C D107.C | D107.C | D107.C D139.C
ROW11  (via drill 0.5)
  Top 0.254: v63.2,25.2 D12.C | D172.C v63.2,10.2 | v63.2,7.2 D204.C | D44.C v63.2,22.2 | v63.2,19.2 D76.C | D108.C v63.2,16.2 | v63.2,13.2 D140.C | v63.2,4.2 D236.C
  Bottom 0.254: D12.C | D12.C v63.2,25.2 | D12.C D44.C | D44.C | D76.C D204.C | D236.C | D236.C 63.64,3.14 61.2,0.7 48,0.7 42.98,5.72 U4.17 | v63.2,10.2 | v63.2,10.2 D172.C D204.C | D204.C | D204.C v63.2,7.2 | D236.C D204.C | D204.C | D76.C | D76.C D44.C | D44.C v63.2,22.2 | v63.2,22.2 | D76.C v63.2,19.2 | v63.2,19.2 | v63.2,16.2 D108.C | D108.C | D108.C D76.C | v63.2,13.2 D140.C D108.C | v63.2,13.2 | D44.C v63.2,22.2 | D236.C v63.2,4.2 | v63.2,4.2
ROW12  (via drill 0.5)
  Top 0.254: v60.2,25.2 D13.C | v60.2,4.2 D237.C | v60.2,7.2 D205.C | v60.2,10.2 D173.C | v60.2,13.2 D141.C | v60.2,16.2 D109.C | v60.2,22.2 D45.C | D77.C v60.2,19.2
  Bottom 0.254: D13.C | D13.C v60.2,25.2 | D13.C D45.C | D77.C D109.C | D109.C 60.64,13 | 60.64,13 60.64,10 | 60.64,10 60.64,7 | 60.64,7 60.64,4 | 60.64,4 60.64,3.14 58.7,1.2 48.3,1.2 43.62,5.88 U4.16 | D237.C | D237.C v60.2,4.2 | D205.C | D205.C v60.2,7.2 | D173.C | D173.C v60.2,10.2 | D237.C 60.64,4 | 60.64,4 | D205.C 60.64,7 | 60.64,7 | D173.C 60.64,10 | 60.64,10 | D141.C | D141.C v60.2,13.2 | D141.C 60.64,13 | 60.64,13 | D109.C | D109.C v60.2,16.2 | D45.C v60.2,22.2 | v60.2,22.2 | v60.2,19.2 | v60.2,19.2 D77.C | D77.C | D77.C D45.C | D45.C v60.2,22.2
ROW13  (via drill 0.5)  (1 unrouted)
  Top 0.254: v57.2,25.2 D14.C | D238.C v57.2,4.2 | v57.2,7.2 D206.C | v57.2,10.2 D174.C | v57.2,22.2 D46.C | v57.2,19.2 D78.C | v57.2,16.2 D110.C | D110.C | v57.2,13.2 D142.C
  Bottom 0.254: D14.C | D14.C v57.2,25.2 | D14.C D46.C | D78.C D110.C | D110.C D174.C | v57.2,4.2 D238.C | D238.C 57.64,3.14 56.2,1.7 48.6,1.7 44.27,6.03 U4.15 | D206.C | D206.C v57.2,7.2 | D174.C | D174.C v57.2,10.2 | D238.C D206.C | D206.C D174.C | D46.C v57.2,22.2 | v57.2,22.2 | D78.C v57.2,19.2 | v57.2,19.2 | D110.C v57.2,16.2 | v57.2,16.2 | v57.2,16.2 D110.C | v57.2,13.2 D142.C D110.C | v57.2,13.2 | D78.C | D78.C D46.C | D46.C v57.2,22.2
ROW14  (via drill 0.5)  (3 unrouted)
  Top 0.254: v54.2,25.2 D15.C | v54.2,4.2 D239.C | v54.2,7.2 D207.C | v54.2,10.2 D175.C | v54.2,13.2 D143.C | v54.2,16.2 D111.C | v54.2,22.2 D47.C | D79.C v54.2,19.2
  Bottom 0.254: D15.C | D15.C v54.2,25.2 | D15.C D47.C | D47.C | D79.C D111.C | D239.C v54.2,4.2 | D207.C | D207.C v54.2,7.2 | D175.C v54.2,10.2 | D239.C 54.64,3.14 53.7,2.2 48.9,2.2 44.92,6.17 U4.14 | D239.C D207.C | D143.C v54.2,13.2 | v54.2,13.2 | D175.C D143.C | D111.C v54.2,16.2 | D79.C | D79.C D47.C | D47.C v54.2,22.2 | v54.2,19.2 D79.C | D79.C | D143.C | D207.C | D207.C D175.C | D143.C D111.C
ROW15  (via drill 0.5)  (1 unrouted)
  Top 0.254: v51.2,25.2 D16.C | D240.C v51.2,4.2 | D208.C v51.2,7.2 | v51.2,7.2 | v51.2,10.2 D176.C | v51.2,13.2 D144.C | v51.2,16.2 D112.C | v51.2,22.2 D48.C | v51.2,19.2 D80.C
  Bottom 0.254: D16.C | D16.C v51.2,25.2 | D16.C D48.C | D48.C | D80.C D112.C | 51.64,13.76 D144.C | D144.C D240.C | D144.C 51.57,13.7 51.64,13.76 | v51.2,4.2 D240.C | U4.13 47.63,13.64 D144.C | D240.C | D240.C D208.C | v51.2,7.2 | v51.2,7.2 D208.C | v51.2,10.2 D176.C D208.C | v51.2,10.2 | D144.C v51.2,13.2 | v51.2,13.2 | D112.C v51.2,16.2 | v51.2,16.2 | D48.C v51.2,22.2 | v51.2,22.2 | D80.C v51.2,19.2 | v51.2,19.2 | D80.C | D80.C D48.C | D48.C v51.2,22.2 | 51.64,13.76 D112.C | D112.C v51.2,16.2 | D144.C v51.2,13.2
RXD0  (1 unrouted)
TXD0  (1 unrouted)
V+  (1 unrouted)
  Top 0.254: 25.98,5.6 C1.1 21.68,5.6 FB1.1
  Top 0.305: C2.1 33.44,12.2 U1.32 31.34,14.3 29.1,14.3 27.1,12.3 27.1,9.27 26.68,8.85
VDD  (via drill 0.5)  (2 unrouted)
  Top 0.254: v13.9,17.1 13.95,17.05 | U1.17 22.64,14.1 v24.7,14.1 | J1.2 33.21,24.8 R2.1 | U3.7 U3.8 17.28,22.72 18.32,21.68 R39.2 R38.2
  Top 0.305: U3.8 15.8,22.29 C9.1 15.8,15.6 | U1.17 21.41,14.2 C3.1 18.7,14.2 17.5,15.4 | v32.5,2.8 31.8,2.8 31.5,2.5 18.9,2.5 13.9,7.5 v13.9,7.8 | FB1.2 18.3,5.5 16.2,7.6 v16.2,7.8
  Bottom 0.254: C6.1 38.42,11.97 U4.24 38.42,9.53 38,9.1 | J1.2 31.34,19.64 25.8,14.1 v24.7,14.1
  Bottom 0.305: 38,9.1 37.5,9.1 37.3,8.9 37.3,6.5 33.6,2.8 v32.5,2.8 | v13.9,7.8 v13.9,17.1 | SWT1.2 13.9,19.8 v13.9,17.1 | v16.2,7.8 16.2,14.8 v13.9,17.1

## Text on the board
tPlace: + | PR1 | PR0
bPlace: +5V | GND | 11 16 | Rev A